# Altium project Zumo LF v2.0.PrjPcb (part 2 of 3)

## Sheet IMU.SchDoc: Motherboard-IMU
size A4; Author: Patryk Bujak; DrawnBy: Patryk Bujak; DocumentNumber: 12; Revision: 1.0; SheetNumber: 7; SheetTotal: 10
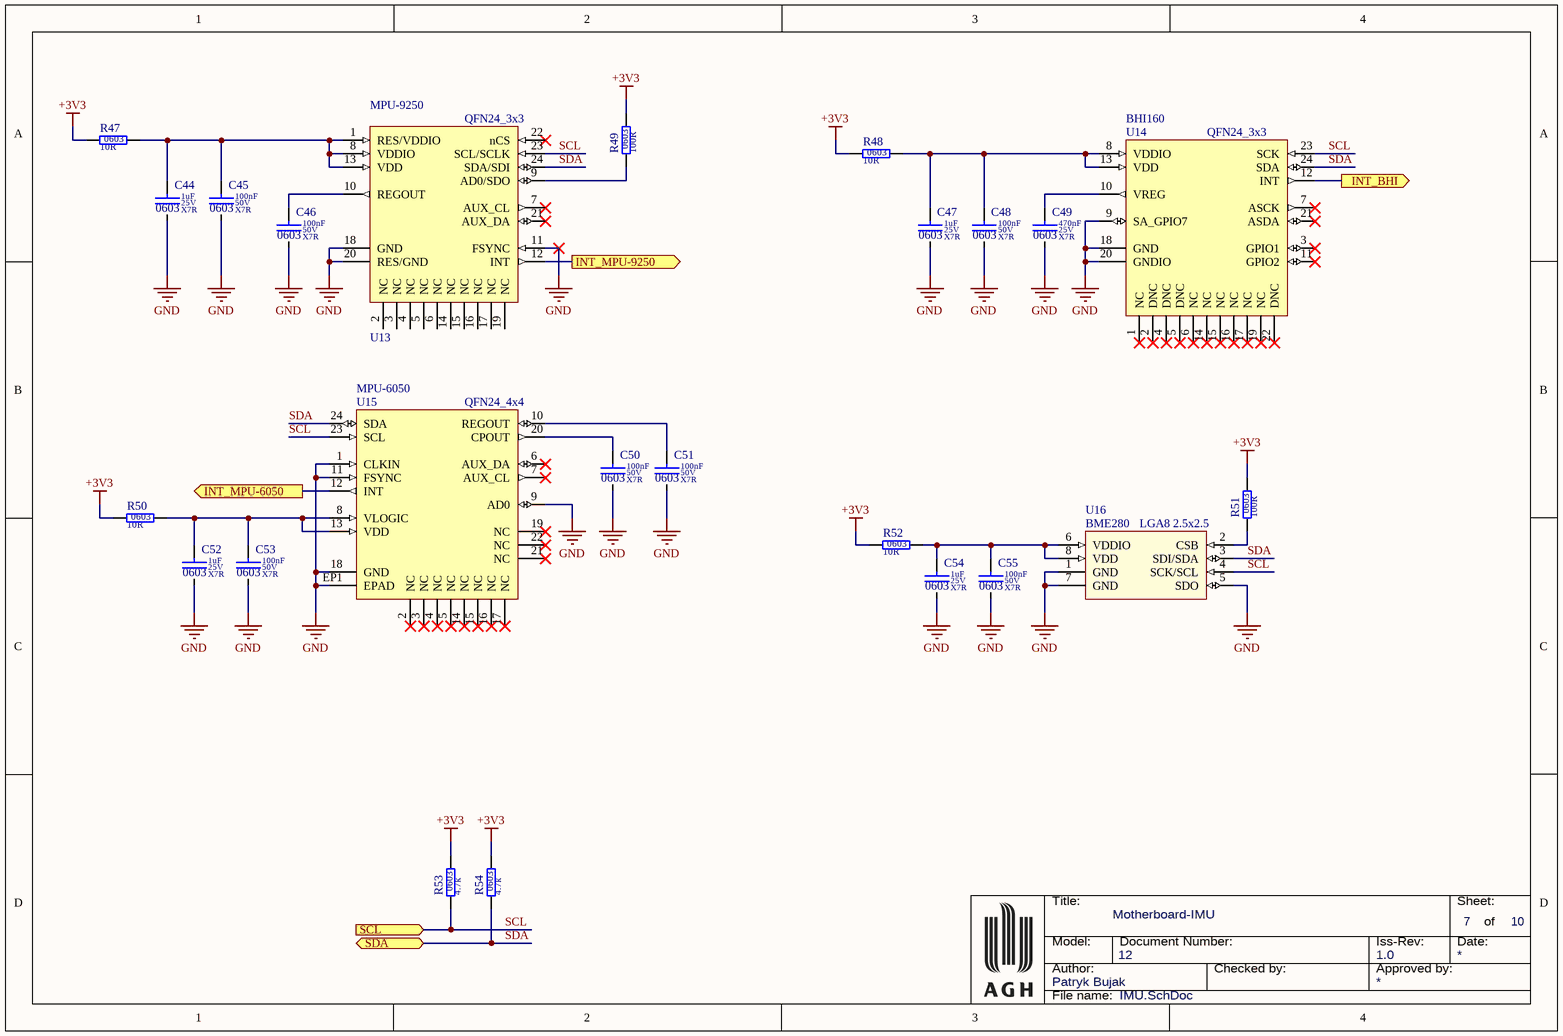
[diagram p5: IMU.SchDoc]

### Parts
C44  value 1uF  Dielectric: X7R  Voltage: 25V  SCH_Footprint: 0603  [C_0603_1608]  (hidden comment: Ceramic X7R)
C45  value 100nF  Dielectric: X7R  Voltage: 50V  SCH_Footprint: 0603  [C_0603_1608]  (hidden comment: Ceramic X7R)
C46  value 100nF  Dielectric: X7R  Voltage: 50V  SCH_Footprint: 0603  [C_0603_1608]  (hidden comment: Ceramic X7R)
C47  value 1uF  Dielectric: X7R  Voltage: 25V  SCH_Footprint: 0603  [C_0603_1608]  (hidden comment: Ceramic X7R)
C48  value 100nF  Dielectric: X7R  Voltage: 50V  SCH_Footprint: 0603  [C_0603_1608]  (hidden comment: Ceramic X7R)
C49  value 470nF  Dielectric: X7R  Voltage: 25V  SCH_Footprint: 0603  [C_0603_1608]  (hidden comment: Ceramic X7R)
C50  value 100nF  Dielectric: X7R  Voltage: 50V  SCH_Footprint: 0603  [C_0603_1608]  (hidden comment: Ceramic X7R)
C51  value 100nF  Dielectric: X7R  Voltage: 50V  SCH_Footprint: 0603  [C_0603_1608]  (hidden comment: Ceramic X7R)
C52  value 1uF  Dielectric: X7R  Voltage: 25V  SCH_Footprint: 0603  [C_0603_1608]  (hidden comment: Ceramic X7R)
C53  value 100nF  Dielectric: X7R  Voltage: 50V  SCH_Footprint: 0603  [C_0603_1608]  (hidden comment: Ceramic X7R)
C54  value 1uF  Dielectric: X7R  Voltage: 25V  SCH_Footprint: 0603  [C_0603_1608]  (hidden comment: Ceramic X7R)
C55  value 100nF  Dielectric: X7R  Voltage: 50V  SCH_Footprint: 0603  [C_0603_1608]  (hidden comment: Ceramic X7R)
R47  value 10R  SCH_Footprint: 0603  [R_0603_1608]  (hidden comment: Resistor)
R48  value 10R  SCH_Footprint: 0603  [R_0603_1608]  (hidden comment: Resistor)
R49  value 100R  SCH_Footprint: 0603  [R_0603_1608]  (hidden comment: Resistor)
R50  value 10R  SCH_Footprint: 0603  [R_0603_1608]  (hidden comment: Resistor)
R51  value 100R  SCH_Footprint: 0603  [R_0603_1608]  (hidden comment: Resistor)
R52  value 10R  SCH_Footprint: 0603  [R_0603_1608]  (hidden comment: Resistor)
R53  value 4.7k  SCH_Footprint: 0603  [R_0603_1608]  (hidden comment: Resistor)
R54  value 4.7k  SCH_Footprint: 0603  [R_0603_1608]  (hidden comment: Resistor)
U13  value MPU-9250  [QFN24_3x3]  (hidden comment: Nine-Axis (Gyro + Accelerometer + Compass) MEMS MotionTracking Device)
U14  value BHI160  [QFN24_3x3]  (hidden comment: Three Axis Ultra Low Power Sensor Hub - LGA-24)
U15  value MPU-6050  [QFN24_4x4]  (hidden comment: Accelerometer and Gyroscope Digital Output 2.5V/3.3V 24-Pin QFN EP)
U16  value BME280  SCH_Footprint: LGA8 2.5x2.5  [LGA8_2.5x2.5]  (hidden comment: Combined humidity and pressure sensor)

### Ports
INT_BHI (out), INT_MPU-6050 (out), INT_MPU-9250 (out), SCL (in), SDA (bidir)

### Nets
+3V3: R47.1 R48.1 R49.2 R50.1 R51.2 R52.1 R53.2 R54.2
GND: C44.2 C45.2 C46.2 C47.2 C48.2 C49.2 C50.2 C51.2 C52.2 C53.2 C54.2 C55.2 U13.11(FSYNC) U13.18(GND) U13.20(RES/GND) U14.9(SA_GPIO7) U14.18(GND) U14.20(GNDIO) U15.1(CLKIN) U15.9(AD0) U15.11(FSYNC) U15.18(GND) U15.EP1(EPAD) U16.1(GND) U16.5(SDO) U16.7(GND)
SCL: R53.1 U13.23(SCL/SCLK) U14.23(SCK) U15.23(SCL) U16.4(SCK/SCL) ; port SCL  [project net BCM3/SCL]
SDA: R54.1 U13.24(SDA/SDI) U14.24(SDA) U15.24(SDA) U16.3(SDI/SDA) ; port SDA  [project net BCM2/SDA]
NetC44_1: C44.1 C45.1 R47.2 U13.1(RES/VDDIO) U13.8(VDDIO) U13.13(VDD)
NetC46_1: C46.1 U13.10(REGOUT)
NetC47_1: C47.1 C48.1 R48.2 U14.8(VDDIO) U14.13(VDD)
NetC49_1: C49.1 U14.10(VREG)
NetC50_1: C50.1 U15.20(CPOUT)
NetC51_1: C51.1 U15.10(REGOUT)
NetC52_1: C52.1 C53.1 R50.2 U15.8(VLOGIC) U15.13(VDD)
NetC54_1: C54.1 C55.1 R52.2 U16.6(VDDIO) U16.8(VDD)
NetR49_1: R49.1 U13.9(AD0/SDO)
NetR51_1: R51.1 U16.2(CSB)
NetU7_24: U15.12(INT) ; port INT_MPU-6050
NetU7_53: U14.12(INT) ; port INT_BHI
NetU7_54: U13.12(INT) ; port INT_MPU-9250

Not connected (* = marked no-connect by the designer): U13 2(NC) 3(NC) 4(NC) 5(NC) 6(NC) 7(AUX_CL)* 14(NC) 15(NC) 16(NC) 17(NC) 19(NC) 21(AUX_DA)* 22(nCS)*; U14 1(NC)* 2(DNC)* 3(GPIO1)* 4(DNC)* 5(DNC)* 6(NC)* 7(ASCK)* 11(GPIO2)* 14(NC)* 15(NC)* 16(NC)* 17(NC)* 19(NC)* 21(ASDA)* 22(DNC)*; U15 2(NC)* 3(NC)* 4(NC)* 5(NC)* 6(AUX_DA)* 7(AUX_CL)* 14(NC)* 15(NC)* 16(NC)* 17(NC)* 19(NC)* 21(NC)* 22(NC)*

### Notes on the sheet
- Title:
- Sheet:
- of
- Author:
- Model:
- Document Number:
- Checked by:
- Iss-Rev:
- Approved by:
- Date:
- File name:

### Library data of the parts
C44 C47 C52 C54 = C_1uF_25V_X7R_0603_10: Capacitor; Manufacturer: Samsung; Manufacturer Part Number: CL10B105KA8NNNC; Tolerance (%): 10; Part Number: C_1uF_25V_X7R_0603_10; HelpURL: http://www.tme.eu/pl/Document/4a42202b32dab16128fe107dd69598cc/samsung-chip-cap.pdf; Supplier 1: TME; Supplier Part Number 1: CL10B105KA8NNNC; Supplier 2: RS Components; Supplier 3: Farnell; Supplier 4: Mouser; Supplier 5: Digi-Key
C45 C46 C48 C50 C51 C53 C55 = C_100nF_50V_X7R_0603_5: Capacitor; Manufacturer: Samsung; Manufacturer Part Number: CL10B104JB8NNNC; Tolerance (%): 5; Part Number: C_100nF_50V_X7R_0603_5; HelpURL: http://www.tme.eu/pl/Document/4a42202b32dab16128fe107dd69598cc/samsung-chip-cap.pdf; Supplier 1: TME; Supplier Part Number 1: CL10B104JB8NNNC; Supplier 2: RS Components; Supplier 3: Farnell; Supplier 4: Mouser; Supplier 5: Digi-Key
C49 = C_470nF_25V_X7R_0603_10: Capacitor; Manufacturer: Murata; Manufacturer Part Number: GRM188R71E474KA12D; Tolerance (%): 10; Part Number: C_470nF_25V_X7R_0603_10; HelpURL: http://www.farnell.com/datasheets/2048708.pdf; Supplier 1: TME; Supplier 2: RS Components; Supplier Part Number 2: 7235654; Supplier 3: Farnell; Supplier Part Number 3: 1828901; Supplier 4: Mouser; Supplier Part Number 4: 81-GRM188R71E474KA12; Supplier 5: Digi-Key; Supplier Part Number 5: 490-3291-1-ND
R47 R48 R50 R52 = R_10R_0603_1: Manufacturer: Royalohm; Manufacturer Part Number: 0603SAF100JT5E; Voltage: 50V; Power: 100mW; Tolerance: 1%; Part Number: R_10R_0603_1; HelpURL: http://www.tme.eu/pl/Document/b315665a56acbc42df513c99b390ad98/ROYALOHM-THICKFILM.pdf; Supplier 1: TME; Supplier Part Number 1: SMD0603-10R-1%; Supplier 2: RS Components; Supplier 3: Farnell; Supplier 4: Mouser; Supplier 5: Digi-Key
R49 R51 = R_100R_0603_1: Manufacturer: Yageo; Manufacturer Part Number: RC0603FR-07100RL; Voltage: 50V; Power: 100mW; Tolerance: 1%; Part Number: R_100R_0603_1; HelpURL: http://www.tme.eu/en/Document/d2a72e545e5c8eb7bf2a04fa97535928/rc0603yageo.pdf; Supplier 1: TME; Supplier Part Number 1: RC0603FR-07100R; Supplier 2: RS Components; Supplier 3: Farnell; Supplier Part Number 3: 2131804; Supplier 4: Mouser; Supplier Part Number 4: 603-RC0603FR-07100RL; Supplier 5: Digi-Key; Supplier Part Number 5: 311-100HRCT-ND
R53 R54 = R_4.7k_0603_1: Manufacturer: Yageo; Manufacturer Part Number: RC0603FR-074K7L; Voltage: 75V; Power: 100mW; Tolerance: 1%; Part Number: R_4.7k_0603_1; HelpURL: http://www.farnell.com/datasheets/2167052.pdf?_ga=2.156163131.1690599162.1548417389-1379097396.1542296996&_gac=1.18389067.1547230258.Cj0KCQiAmuHhBRD0ARIsAFWyPwhX8HcvXnM3tA0ZBodZLzDIjH2ZxLpjT5LWo9bad_HPRbU8LfPq44UaAhEwEALw_wcB; Supplier 1: TME; Supplier Part Number 1: RC0603FR-074K7; Supplier 2: RS Components; Supplier 3: Farnell; Supplier Part Number 3: 9238565; Supplier 4: Mouser; Supplier Part Number 4: 603-RC0603FR-074K7L; Supplier 5: Digi-Key; Supplier Part Number 5: 311-4.70KHRCT-ND
U13 = U_MPU-9250: Manufacturer: InvenSense; SCH_Footprint: QFN24_3x3; Part Number: U_MPU-9250; HelpURL: https://datasheet.octopart.com/MPU-9250-InvenSense-datasheet-21859386.pdf; Manufacturer Part Number: MPU-9250; Supplier 1: TME; Supplier 2: RS Components; Supplier 3: Farnell; Supplier 4: Mouser; Supplier Part Number 4: 410-MPU-9250; Supplier 5: Digi-Key; Supplier Part Number 5: 1428-1019-1-ND
U14 = U_BHI160: Manufacturer: Bosch Tools; SCH_Footprint: QFN24_3x3; Part Number: U_BHI160; HelpURL: https://datasheet.octopart.com/BHI160-Bosch-datasheet-66132459.pdf; Manufacturer Part Number: BHI160; Supplier 1: TME; Supplier 2: RS Components; Supplier 3: Farnell; Supplier 4: Mouser; Supplier Part Number 4: 262-BHI160; Supplier 5: Digi-Key; Supplier Part Number 5: 828-1067-1-ND
U15 = U_MPU-6050: Manufacturer: InvenSense; SCH_Footprint: QFN24_4x4; Part Number: U_MPU-6050; HelpURL: https://datasheet.octopart.com/MPU-6050-InvenSense-datasheet-21631037.pdf; Manufacturer Part Number: MPU-6050; Supplier 1: TME; Supplier 2: RS Components; Supplier Part Number 2: 8837948; Supplier 3: Farnell; Supplier Part Number 3: 1864742; Supplier 4: Mouser; Supplier Part Number 4: 410-MPU-6050; Supplier 5: Digi-Key; Supplier Part Number 5: 1428-1007-1-ND
U16 = U_BME280: Manufacturer: Bosch Tools; Part Number: U_BME280; HelpURL: https://cdn-shop.adafruit.com/datasheets/BST-BME280_DS001-10.pdf; Manufacturer Part Number: BME280; Supplier 1: TME; Supplier 2: RS Components; Supplier 3: Farnell; Supplier 4: Mouser; Supplier Part Number 4: 262-BME280; Supplier 5: Digi-Key; Supplier Part Number 5: 828-1063-1-ND

## Sheet ESP32.SchDoc: Motherboard-ESP32
size A3; DrawnBy: Patryk Bujak; DocumentNumber: 12; Revision: 1.0; SheetNumber: 9; SheetTotal: 10; Author: Patryk Bujak
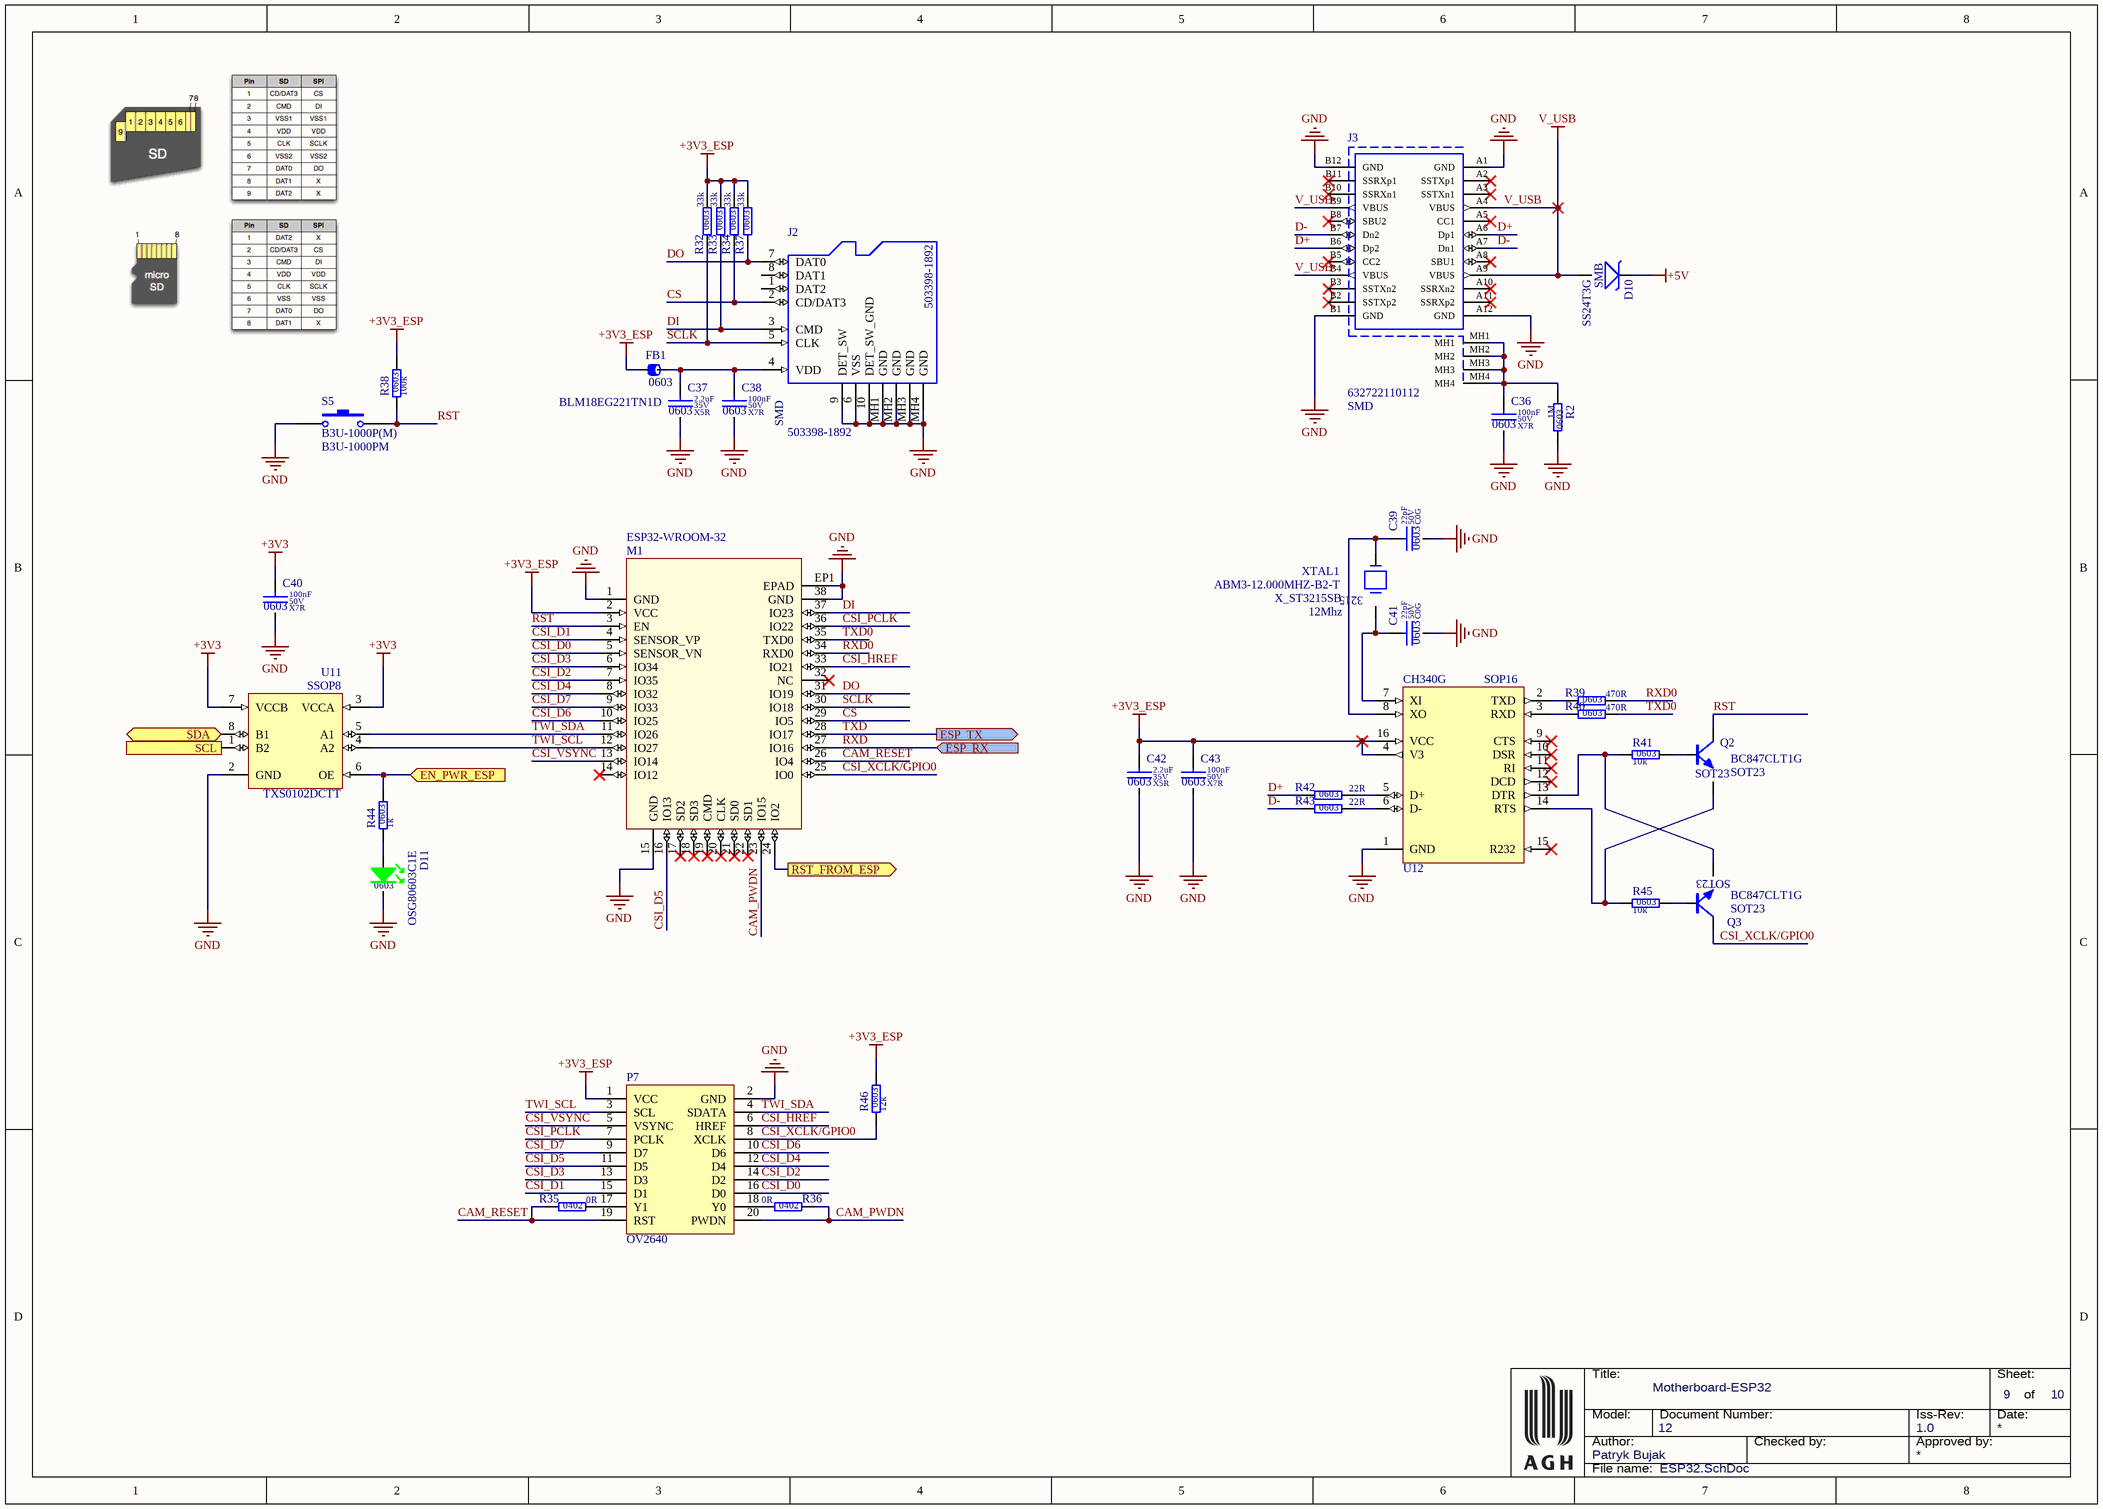
[diagram p6: ESP32.SchDoc]

### Parts
C36  value 100nF  Dielectric: X7R  Voltage: 50V  SCH_Footprint: 0603  [C_0603_1608]  (hidden comment: Ceramic X7R)
C37  value 2.2uF  Dielectric: X5R  Voltage: 35V  SCH_Footprint: 0603  [C_0603_1608]  (hidden comment: Ceramic X5R)
C38  value 100nF  Dielectric: X7R  Voltage: 50V  SCH_Footprint: 0603  [C_0603_1608]  (hidden comment: Ceramic X7R)
C39  value 22pF  Dielectric: C0G  Voltage: 50V  SCH_Footprint: 0603  [C_0603_1608]  (hidden comment: Ceramic C0G)
C40  value 100nF  Dielectric: X7R  Voltage: 50V  SCH_Footprint: 0603  [C_0603_1608]  (hidden comment: Ceramic X7R)
C41  value 22pF  Dielectric: C0G  Voltage: 50V  SCH_Footprint: 0603  [C_0603_1608]  (hidden comment: Ceramic C0G)
C42  value 2.2uF  Dielectric: X5R  Voltage: 35V  SCH_Footprint: 0603  [C_0603_1608]  (hidden comment: Ceramic X5R)
C43  value 100nF  Dielectric: X7R  Voltage: 50V  SCH_Footprint: 0603  [C_0603_1608]  (hidden comment: Ceramic X7R)
D10  value SS24T3G  SCH_Footprint: SMB  [SMB_DO-214AA]  (hidden comment: SS24)
D11  value OSG80603C1E  SCH_Footprint: 0603  [OL_0603_1608]  (hidden comment: Green led)
FB1  value BLM18EG221TN1D  SCH_Footprint: 0603  [FB_0603_1608]  (hidden comment: Ferrite bead)
J2  value 503398-1892  SCH_Footprint: SMD  [503398-1892]  (hidden comment: SD Card Connector)
J3  value 632722110112  SCH_Footprint: SMD  [J_USB_C_3.1_Vertical]  (hidden comment: USB C Connector)
M1  value ESP32-WROOM-32  [MOD_ESP_WROOM_32]  (hidden comment: 2.4 GHz Wi-Fi-and-Bluetooth combo chip)
P7  OV2640  [H2X10_OV2640]
Q2  value BC847CLT1G  SCH_Footprint: SOT23  [SOT23_TO236_SC59]  (hidden comment: BC847C)
Q3  value BC847CLT1G  SCH_Footprint: SOT23  [SOT23_TO236_SC59]  (hidden comment: BC847C)
R2  value 1M  SCH_Footprint: 0603  [R_0603_1608]  (hidden comment: Resistor)
R32  value 33k  SCH_Footprint: 0603  [R_0603_1608]  (hidden comment: Resistor)
R33  value 33k  SCH_Footprint: 0603  [R_0603_1608]  (hidden comment: Resistor)
R34  value 33k  SCH_Footprint: 0603  [R_0603_1608]  (hidden comment: Resistor)
R35  value 0R  SCH_Footprint: 0402  [R_0402_1005]  (hidden comment: Resistor)
R36  value 0R  SCH_Footprint: 0402  [R_0402_1005]  (hidden comment: Resistor)
R37  value 33k  SCH_Footprint: 0603  [R_0603_1608]  (hidden comment: Resistor)
R38  value 100k  SCH_Footprint: 0603  [R_0603_1608]  (hidden comment: Resistor)
R39  value 470R  SCH_Footprint: 0603  [R_0603_1608]  (hidden comment: Resistor)
R40  value 470R  SCH_Footprint: 0603  [R_0603_1608]  (hidden comment: Resistor)
R41  value 10k  SCH_Footprint: 0603  [R_0603_1608]  (hidden comment: Resistor)
R42  value 22R  SCH_Footprint: 0603  [R_0603_1608]  (hidden comment: Resistor)
R43  value 22R  SCH_Footprint: 0603  [R_0603_1608]  (hidden comment: Resistor)
R44  value 1k  SCH_Footprint: 0603  [R_0603_1608]  (hidden comment: Resistor)
R45  value 10k  SCH_Footprint: 0603  [R_0603_1608]  (hidden comment: Resistor)
R46  value 12k  SCH_Footprint: 0603  [R_0603_1608]  (hidden comment: Resistor)
S5  value B3U-1000PM  SCH_Footprint: B3U-1000P(M)  [B3U-1000P]  (hidden comment: Ultra-small Tactile Switch)
U11  value TXS0102DCTT  SCH_Footprint: SSOP8  [SSOP8_3x3]  (hidden comment: 2-Bit Bidirectional Voltage-Level Shifter for Open-Drain and Push-Pull Application 8-VSSOP -40 to 85)
U12  value CH340G  SCH_Footprint: SOP16  [SOP16_SO16_SOIC16_4X10X6]  (hidden comment: USB to serial chip)
XTAL1  value 12Mhz  Manufacturer Part Number: ABM3-12.000MHZ-B2-T  [X_ABM3-12.000MHZ-B2-T]  (hidden comment: X_ST3215SB)

### Ports
EN_PWR_ESP (in), ESP_RX (in), ESP_TX (out), RST_FROM_ESP (out), SCL (in), SDA (bidir)

### Nets
+3V3: C40.1 U11.3(VCCA) U11.7(VCCB)
+3V3_ESP: C42.1 C43.1 FB1.1 M1.2(VCC) P7.1(VCC) R32.2 R33.2 R34.2 R37.2 R38.2 R46.2 U12.4(V3) U12.16(VCC)
+5V: D10.1
GND: C36.2 C37.2 C38.2 C39.2 C40.2 C41.2 C42.2 C43.2 D11.1(K) J2.6(VSS) J2.9(DET_SW) J2.10(DET_SW_GND) J2.MH1(GND) J2.MH2(GND) J2.MH3(GND) J2.MH4(GND) J3.A1(GND) J3.A12(GND) J3.B1(GND) J3.B12(GND) M1.1(GND) M1.15(GND) M1.38(GND) M1.EP1(EPAD) P7.2(GND) R2.2 S5.1 U11.2(GND) U12.1(GND)
V_USB: D10.2 J3.A4(VBUS) J3.A9(VBUS) J3.B4(VBUS) J3.B9(VBUS)
BCM2/SDA: U11.8(B1) ; port SDA
BCM3/SCL: U11.1(B2) ; port SCL
CAM_PWDN: M1.23(IO15) P7.20(PWDN) R36.2
CAM_RESET: M1.26(IO4) P7.19(RST) R35.1
CS: J2.2(CD/DAT3) M1.29(IO5) R34.1
CSI_D0: M1.5(SENSOR_VN) P7.16(D0)
CSI_D1: M1.4(SENSOR_VP) P7.15(D1)
CSI_D2: M1.7(IO35) P7.14(D2)
CSI_D3: M1.6(IO34) P7.13(D3)
CSI_D4: M1.8(IO32) P7.12(D4)
CSI_D5: M1.16(IO13) P7.11(D5)
CSI_D6: M1.10(IO25) P7.10(D6)
CSI_D7: M1.9(IO33) P7.9(D7)
CSI_HREF: M1.33(IO21) P7.6(HREF)
CSI_PCLK: M1.36(IO22) P7.7(PCLK)
CSI_VSYNC: M1.13(IO14) P7.5(VSYNC)
CSI_XCLK/GPIO0: M1.25(IO0) P7.8(XCLK) Q3.3(C) R46.1
D+: J3.A6(Dp1) J3.B6(Dp2) R42.1
D-: J3.A7(Dn1) J3.B7(Dn2) R43.1
DI: J2.3(CMD) M1.37(IO23) R33.1
DO: J2.7(DAT0) M1.31(IO19) R37.1
RST: M1.3(EN) Q2.3(C) R38.1 S5.2
RXD: M1.27(IO16) ; port ESP_RX
RXD0: M1.34(RXD0) R39.2
SCLK: J2.5(CLK) M1.30(IO18) R32.1
TWI_SCL: M1.12(IO27) P7.3(SCL) U11.4(A2)
TWI_SDA: M1.11(IO26) P7.4(SDATA) U11.5(A1)
TXD: M1.28(IO17) ; port ESP_TX
TXD0: M1.35(TXD0) R40.2
NetC36_1: C36.1 J3.MH1 J3.MH2 J3.MH3 J3.MH4 R2.1
NetC37_1: C37.1 C38.1 FB1.2 J2.4(VDD)
NetC39_1: C39.1 U12.8(XO) XTAL1.2
NetC41_1: C41.1 U12.7(XI) XTAL1.1
NetD11_2: D11.2(A) R44.1
NetM1_24: M1.24(IO2) ; port RST_FROM_ESP
NetP7_17: P7.17(Y1) R35.2
NetP7_18: P7.18(Y0) R36.1
NetQ2_1: Q2.1(B) R41.2
NetQ2_2: Q2.2(E) R45.1 U12.14(RTS)
NetQ3_1: Q3.1(B) R45.2
NetQ3_2: Q3.2(E) R41.1 U12.13(DTR)
NetR11_2: R44.2 U11.6(OE) ; port EN_PWR_ESP
NetR39_1: R39.1 U12.2(TXD)
NetR40_1: R40.1 U12.3(RXD)
NetR42_2: R42.2 U12.5(D+)
NetR43_2: R43.2 U12.6(D-)

Not connected (* = marked no-connect by the designer): J2 1(DAT2) 8(DAT1); J3 A2(SSTXp1)* A3(SSTXn1)* A5(CC1)* A8(SBU1)* A10(SSRXn2)* A11(SSRXp2)* B2(SSTXp2)* B3(SSTXn2)* B5(CC2)* B8(SBU2)* B10(SSRXn1)* B11(SSRXp1)*; M1 14(IO12)* 17(SD2)* 18(SD3)* 19(CMD)* 20(CLK)* 21(SD0)* 22(SD1)* 32(NC)*; U12 9(CTS)* 10(DSR)* 11(RI)* 12(DCD)* 15(R232)*

### Notes on the sheet
- Title:
- Sheet:
- of
- Author:
- Model:
- Document Number:
- Checked by:
- Iss-Rev:
- Approved by:
- Date:
- File name:
- (in symbol X_ABM3-12.000MHZ-B2-T) 3215

### Library data of the parts
C36 C38 C40 C43 = C_100nF_50V_X7R_0603_5: as C45 on sheet IMU; Part Number: C_100nF_50V_X7R_0603_5; HelpURL: http://www.tme.eu/pl/Document/4a42202b32dab16128fe107dd69598cc/samsung-chip-cap.pdf; Supplier 1: TME; Supplier Part Number 1: CL10B104JB8NNNC; Supplier 2: RS Components; Supplier 3: Farnell; Supplier 4: Mouser; Supplier 5: Digi-Key
C37 C42 = C_2.2uF_35V_X5R_0603_10: Capacitor; Manufacturer: Murata; Manufacturer Part Number: GRM188R6YA225KA12D; Tolerance (%): 10; Part Number: C_2.2uF_35V_X5R_0603_10; HelpURL: https://datasheet.octopart.com/GRM188R6YA225KA12D-Murata-datasheet-66077095.pdf; Supplier 1: TME; Supplier 2: RS Components; Supplier Part Number 2: 8151358; Supplier 3: Farnell; Supplier Part Number 3: 2611926; Supplier 4: Mouser; Supplier Part Number 4: 81-GRM188R6YA225KA2D; Supplier 5: Digi-Key; Supplier Part Number 5: 490-7204-1-ND
C39 C41 = C_22pF_50V_C0G_0603_5: Capacitor; Manufacturer: AVX; Manufacturer Part Number: 06035A220JAT2A; Tolerance (%): 5; Part Number: C_22pF_50V_C0G_0603_5; HelpURL: https://datasheet.octopart.com/06035A220JAT2A-AVX-datasheet-9883399.pdf; Supplier 1: TME; Supplier 2: RS Components; Supplier Part Number 2: 1349628; Supplier 3: Farnell; Supplier Part Number 3: 2280861; Supplier 4: Mouser; Supplier Part Number 4: 581-06035A220J; Supplier 5: Digi-Key; Supplier Part Number 5: 478-1167-1-ND
D10 = DS_SS24_2A_40V_SMB: Manufacturer: ON Semiconductor; Voltage: 40V; Current: 2A; Part Number: DS_SS24_2A_40V_SMB; Manufacturer Part Number: SS24T3G; Supplier 1: TME; Supplier 2: RS Components; Supplier 3: Farnell; Supplier 4: Mouser; Supplier 5: Digi-Key; Supplier Part Number 5: SS24T3GOSCT-ND
D11 = OL_G_0603_OSG80603C1E: LED GREEN; Manufacturer: Optosupply; Part Number: OL_G_0603_OSG80603C1E; Manufacturer Part Number: OSG80603C1E; Supplier 1: TME; Supplier Part Number 1: OSG80603C1E; Supplier 2: RS Components; Supplier 3: Farnell; Supplier 4: Mouser; Supplier 5: Digi-Key
FB1 = FB_BLM18EG221TN1D: Manufacturer: Murata; Current: 1A; Resistance: 150mR; Part Number: FB_BLM18EG221TN1D; HelpURL: http://datasheet.octopart.com/BLM18EG221TN1D-Murata-datasheet-66919.pdf; Manufacturer Part Number: BLM18EG221TN1D; Supplier 1: TME; Supplier 2: RS Components; Supplier Part Number 2: 7926243P; Supplier 3: Farnell; Supplier Part Number 3: 1515717; Supplier 4: Mouser; Supplier Part Number 4: 81-BLM18EG221TN1D; Supplier 5: Digi-Key; Supplier Part Number 5: 490-5979-1-ND
J2 = J_MICRO_SD_503398-1892: J_MICRO_SD; Manufacturer: Molex; Manufacturer Part Number: 503398-1892; Part Number: J_MICRO_SD_503398-1892; Component Type: Standard; HelpURL: https://www.molex.com/pdm_docs/sd/5033981892_sd.pdf; Supplier 1: TME; Supplier Part Number 1: MX-503398-1892; Supplier 2: RS Components; Supplier Part Number 2: 8801277P; Supplier 3: Farnell; Supplier Part Number 3: 2358233; Supplier 4: Mouser; Supplier Part Number 4: 538-503398-1892; Supplier 5: Digi-Key; Supplier Part Number 5: WM11190CT-ND
J3 = J_USB_C_3.1_Vertical: Manufacturer: Wurth; Part Number: J_USB_C_3.1_Vertical; Component Type: Standard; HelpURL: https://docs-emea.rs-online.com/webdocs/16e6/0900766b816e664c.pdf; Manufacturer Part Number: 632722110112; Supplier 1: TME; Supplier 2: RS Components; Supplier Part Number 2: 185-4394; Supplier 3: Farnell; Supplier 4: Mouser; Supplier Part Number 4: 710-632722110112; Supplier 5: Digi-Key; Supplier Part Number 5: 732-13724-1-ND
M1 = MOD_ESP32-WROOM-32: Manufacturer: ESPRESSIF; SCH_Footprint: MOD_ESP_WROOM_32; Part Number: MOD_ESP32-WROOM-32; HelpURL: https://www.espressif.com/sites/default/files/documentation/esp32_datasheet_en.pdf; Manufacturer Part Number: ESP32-WROOM-32; Supplier 1: TME; Supplier Part Number 1: ESP32-WROOM-32; Supplier 2: RS Components; Supplier Part Number 2: 169-7594; Supplier 3: Farnell; Supplier 4: Mouser; Supplier Part Number 4: 356-ESP-WROOM-32; Supplier 5: Digi-Key; Supplier Part Number 5: 1904-1010-1-ND
P7 = OV2640: Header, 11-Pin, Dual row, Right Angle; LatestRevisionDate: 17-Jul-2002; LatestRevisionNote: Re-released for DXP Platform.; Publisher: Altium Limited; botland: https://botland.com.pl/pl/kamery-do-arduino-i-raspberry-pi/6562-modul-kamery-arducam-ov2640-2mpx-1600x1200px-60fps.html?search_query=OV2640&results=11; link: https://www.arducam.com/products/camera-breakout-board/2mp-ov2640/
Q2 Q3 = QNP_BC847C_45V_0A1: Manufacturer: ON Semiconductor; Type: NPN; Voltage: 45V; Current: 0A1; Part Number: QNP_BC847C_45V_0A1; HelpURL: https://assets.nexperia.com/documents/data-sheet/BC847_SER.pdf; Manufacturer Part Number: BC847CLT1G; Supplier 1: TME; Supplier Part Number 1: BC847CLT1G; Supplier 2: RS Components; Supplier 3: Farnell; Supplier 4: Mouser; Supplier 5: Digi-Key; Supplier Part Number 5: BC847CLT1GOSCT-ND
R2 = R_1M_0603_1: Manufacturer: Bourns; Manufacturer Part Number: CR0603-FX-1004ELF; Voltage: 50V; Power: 100mW; Tolerance: 1%; Part Number: R_1M_0603_1; HelpURL: https://datasheet.octopart.com/CR0603-FX-1004ELF-Bourns-datasheet-5318152.pdf; Supplier 1: TME; Supplier 2: RS Components; Supplier 3: Farnell; Supplier Part Number 3: 2321755; Supplier 4: Mouser; Supplier Part Number 4: 652-CR0603FX-1004ELF; Supplier 5: Digi-Key; Supplier Part Number 5: CR0603-FX-1004ELFCT-ND
R32-R34 R37 = R_33k_0603_1: Manufacturer: Vishay; Manufacturer Part Number: CRCW060333K0FKTABC; Voltage: 75V; Power: 100mW; Tolerance: 1%; Part Number: R_33k_0603_1; HelpURL: http://www.tme.eu/pl/Document/622e28308c06d160637f2b14751ba16b/Data%20Sheet%20CRCW_BCe3.pdf; Supplier 1: TME; Supplier Part Number 1: CRCW060333K0FKTABC; Supplier 2: RS Components; Supplier 3: Farnell; Supplier 4: Mouser; Supplier Part Number 4: 71-CRCW0603-33K; Supplier 5: Digi-Key
R35 R36 = R_0R_0402_5: Manufacturer: Rohm; Manufacturer Part Number: PMR01ZZPJ000; Voltage: 50V; Power: 100mW; Tolerance: 5%; Part Number: R_0R_0402_5; HelpURL: https://pl.mouser.com/datasheet/2/348/pmr-jpw-e-1139188.pdf; Supplier 1: TME; Supplier 2: RS Components; Supplier 3: Farnell; Supplier 4: Mouser; Supplier Part Number 4: 755-PMR01ZZPJ000; Supplier 5: Digi-Key; Supplier Part Number 5: RHM1692-6-ND
R38 = R_100k_0603_1: Manufacturer: Royalohm; Manufacturer Part Number: 0603SAF1003T5E; Voltage: 50V; Power: 100mW; Tolerance: 1%; Part Number: R_100k_0603_1; HelpURL: http://www.tme.eu/pl/Document/b315665a56acbc42df513c99b390ad98/ROYALOHM-THICKFILM.pdf; Supplier 1: TME; Supplier Part Number 1: SMD0603-100K-1%; Supplier 2: RS Components; Supplier 3: Farnell; Supplier 4: Mouser; Supplier Part Number 4: 667-ERJ-3EKF1003V; Supplier 5: Digi-Key; Supplier Part Number 5: P100KHCT-ND
R39 R40 = R_470R_0603_1: Manufacturer: Yageo; Manufacturer Part Number: RC0603FR-07470RL; Voltage: 50V; Power: 100mW; Tolerance: 1%; Part Number: R_470R_0603_1; HelpURL: http://www.tme.eu/en/Document/9fef8ccbb584e9f6a1c931cf356afd5c/PYu-RC0603_51_RoHS_L_4.pdf; Supplier 1: TME; Supplier Part Number 1: RC0603FR-07470R; Supplier 2: RS Components; Supplier 3: Farnell; Supplier Part Number 3: 9238441; Supplier 4: Mouser; Supplier Part Number 4: 603-RC0603FR-07470RL; Supplier 5: Digi-Key; Supplier Part Number 5: 311-470HRCT-ND
R41 R45 = R_10k_0603_1: Manufacturer: Vishay; Manufacturer Part Number: CRCW060310K0FKTABC; Voltage: 75V; Power: 100mW; Tolerance: 1%; Part Number: R_10k_0603_1; HelpURL: http://www.tme.eu/pl/Document/622e28308c06d160637f2b14751ba16b/Data%20Sheet%20CRCW_BCe3.pdf; Supplier 1: TME; Supplier Part Number 1: CRCW060310K0FKTABC; Supplier 2: RS Components; Supplier 3: Farnell; Supplier 4: Mouser; Supplier Part Number 4: 667-ERJ-3EKF1002V; Supplier 5: Digi-Key; Supplier Part Number 5: P10KGCT-ND
R42 R43 = R_22R_0603_5: Manufacturer: Walsin; Manufacturer Part Number: WF06P220JTL; Voltage: 50V; Power: 125mW; Tolerance: 5%; Part Number: R_22R_0603_5; HelpURL: http://www.tme.eu/pl/Document/b315665a56acbc42df513c99b390ad98/ROYALOHM-THICKFILM.pdf; Supplier 1: TME; Supplier Part Number 1: WF06P-22R-5%; Supplier 2: RS Components; Supplier 3: Farnell; Supplier 4: Mouser; Supplier 5: Digi-Key
R44 = R_1k_0603_1: Manufacturer: Vishay; Manufacturer Part Number: CRCW06031K00FKEA; Voltage: 75V; Power: 100mW; Tolerance: 1%; Part Number: R_1k_0603_1; HelpURL: http://www.farnell.com/datasheets/2310790.pdf?_ga=2.256888843.1690599162.1548417389-1379097396.1542296996&_gac=1.262631934.1547230258.Cj0KCQiAmuHhBRD0ARIsAFWyPwhX8HcvXnM3tA0ZBodZLzDIjH2ZxLpjT5LWo9bad_HPRbU8LfPq44UaAhEwEALw_wcB; Supplier 1: TME; Supplier 2: RS Components; Supplier Part Number 2: 678-9875P; Supplier 3: Farnell; Supplier Part Number 3: 1469740; Supplier 4: Mouser; Supplier Part Number 4: 71-CRCW0603-1.0K-E3; Supplier 5: Digi-Key; Supplier Part Number 5: 541-1.00KHCT-ND
R46 = R_12k_0603_1: Manufacturer: Yageo; Manufacturer Part Number: RC0603FR-0712KL; Voltage: 50V; Power: 100mW; Tolerance: 1%; Part Number: R_12k_0603_1; HelpURL: http://www.tme.eu/pl/Document/d2a72e545e5c8eb7bf2a04fa97535928/rc0603yageo.pdf; Supplier 1: TME; Supplier Part Number 1: RC0603FR-0712K; Supplier 2: RS Components; Supplier 3: Farnell; Supplier Part Number 3: 2693657; Supplier 4: Mouser; Supplier Part Number 4: 603-RC0603FR-0712KL; Supplier 5: Digi-Key; Supplier Part Number 5: 311-12.0KHRCT-ND
S5 = S_B3U-1000PM: Tact Switch; Manufacturer: OMRON; Part Number: S_B3U-1000PM; HelpURL: https://www.tme.eu/Document/abdade7e1ca56d20235b5c747d7227eb/B3U.PDF; Manufacturer Part Number: B3U-1000PM; Supplier 1: TME; Supplier Part Number 1: B3U-1000PM; Supplier 2: RS Components; Supplier 3: Farnell; Supplier 4: Mouser; Supplier Part Number 4: 653-B3U-1000PM; Supplier 5: Digi-Key
U11 = U_TXS0102DCTT: Manufacturer: Texas Instruments; Part Number: U_TXS0102DCTT; HelpURL: http://www.ti.com/lit/ds/symlink/txs0102.pdf; Manufacturer Part Number: TXS0102DCTT; Supplier 1: TME; Supplier 2: RS Components; Supplier Part Number 2: 7098912P; Supplier 3: Farnell; Supplier Part Number 3: 2098018; Supplier 4: Mouser; Supplier Part Number 4: 595-TXS0102DCTT; Supplier 5: Digi-Key; Supplier Part Number 5: 296-32603-1-ND
U12 = U_CH340G: Manufacturer: WCH; Part Number: U_CH340G; HelpURL: https://www.mpja.com/download/35227cpdata.pdf; Manufacturer Part Number: CH340G; Supplier 1: TME; Supplier 2: RS Components; Supplier 3: Farnell; Supplier 4: Mouser; Supplier 5: Digi-Key; Supplier 6: WCH; Supplier Part Number 6: CH340G
XTAL1 = X_ABM3-12.000MHZ-B2-T: Manufacturer: ABM3; Part Number: X_ABM3-12.000MHZ-B2-T; SCH_Footprint: X_ST3215SB; HelpURL: http://www.mouser.com/ds/2/3/abm3-47699.pdf; Supplier 1: TME; Supplier 2: RS Components; Supplier 3: Farnell; Supplier Part Number 3: 2467787; Supplier 4: Mouser; Supplier 5: Digi-Key; Supplier Part Number 5: 535-9100-1-ND

## Sheet RPi.SchDoc: Motherboard-RPi
size A4; Author: Patryk Bujak; DrawnBy: Patryk Bujak; DocumentNumber: 12; Revision: 1.0; SheetNumber: 5; SheetTotal: 10
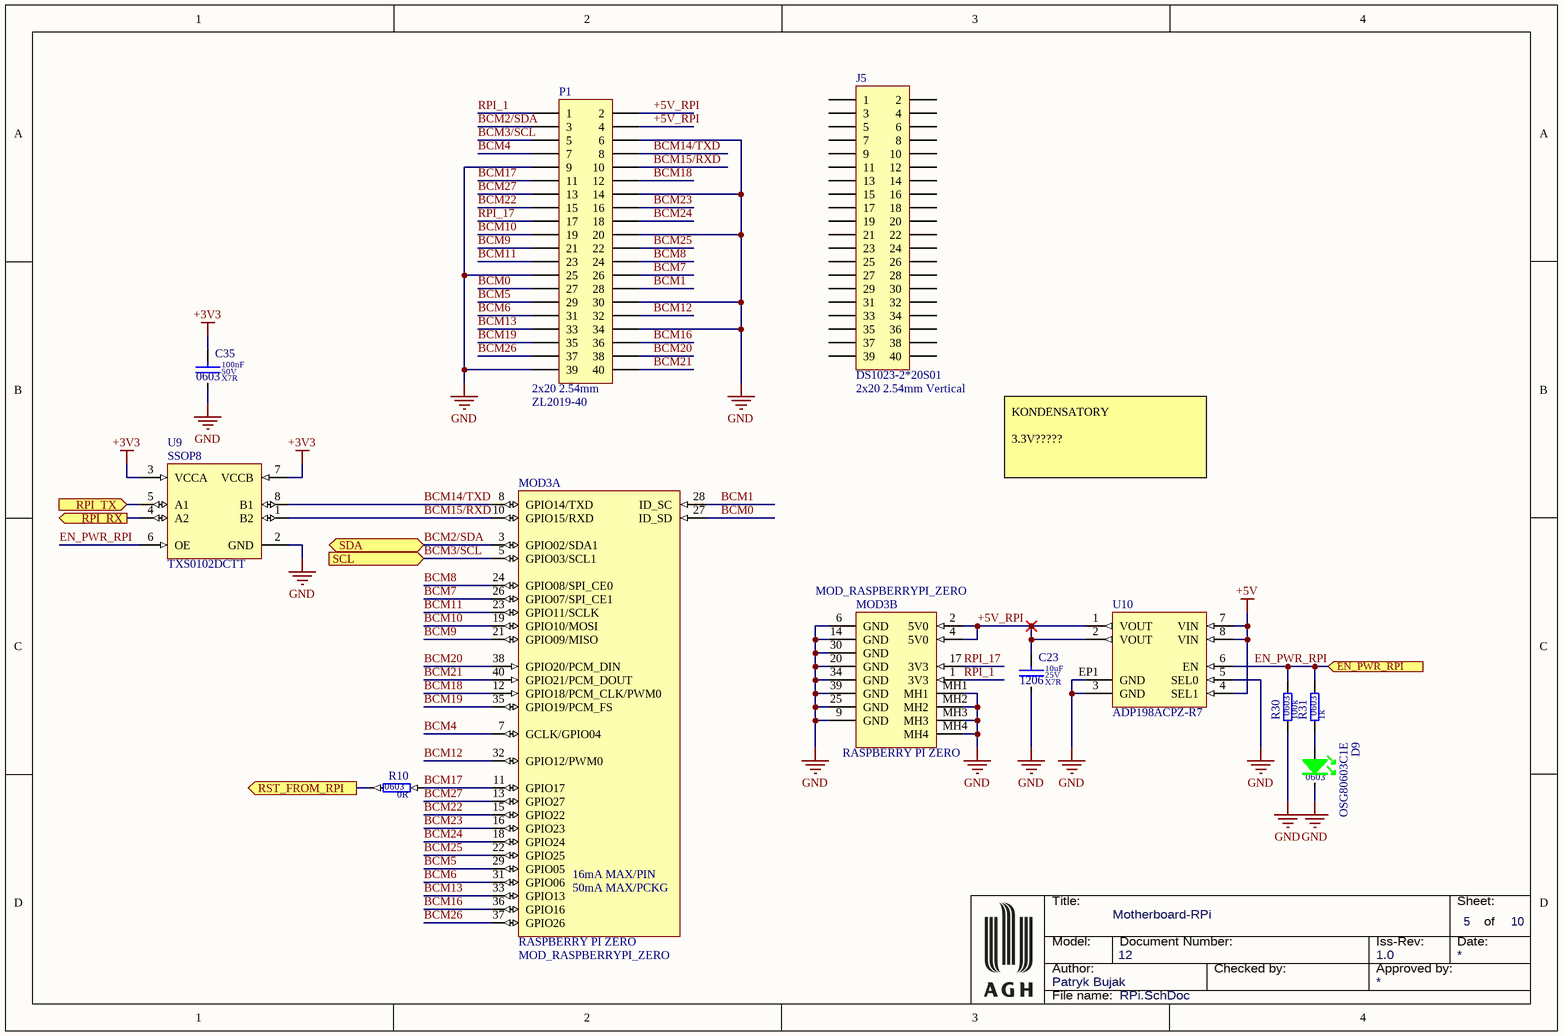
[diagram p7: RPi.SchDoc]

### Parts
C23  value 10uF  Dielectric: X7R  Voltage: 25V  SCH_Footprint: 1206  [C_1206_3216]  (hidden comment: Ceramic X7R)
C35  value 100nF  Dielectric: X7R  Voltage: 50V  SCH_Footprint: 0603  [C_0603_1608]  (hidden comment: Ceramic X7R)
D9  value OSG80603C1E  SCH_Footprint: 0603  [OL_0603_1608]  (hidden comment: Green led)
J5  value DS1023-2*20S01  SCH_Footprint: 2x20 2.54mm Vertical  [J_HEADER_2x20_2.54_VERTICAL]  (hidden comment: Goldpin female straight)
MOD3  value RASPBERRY PI ZERO  [MOD_RASPBERRYPI_ZERO]  (hidden comment: MOD_RASPBERRYPI_ZERO)  (parts A,B of 2)
P1  value ZL2019-40  SCH_Footprint: 2x20 2.54mm  [P_HEADER_2x20_2.54_HIGH]  (hidden comment: Goldpin)
R10  value 0R  SCH_Footprint: 0603  [R_0603_1608]  (hidden comment: Resistor)
R30  value 100k  SCH_Footprint: 0603  [R_0603_1608]  (hidden comment: Resistor)
R31  value 1k  SCH_Footprint: 0603  [R_0603_1608]  (hidden comment: Resistor)
U9  value TXS0102DCTT  SCH_Footprint: SSOP8  [SSOP8_3x3]  (hidden comment: 2-Bit Bidirectional Voltage-Level Shifter for Open-Drain and Push-Pull Application 8-VSSOP -40 to 85)
U10  value ADP198ACPZ-R7  SCH_Footprint: LFCSP8  [LFCSP-8-10]  (hidden comment: high-side load switch)

### Ports
EN_PWR_RPI (in), RPI_RX (out), RPI_TX (in), RST_FROM_RPI (out), SCL (in), SDA (bidir)

### Nets
+3V3: C35.1 U9.3(VCCA) U9.7(VCCB)
+5V: U10.4(SEL1) U10.7(VIN) U10.8(VIN)
GND: C23.2 C35.2 D9.1(K) MOD3.6(GND) MOD3.9(GND) MOD3.14(GND) MOD3.20(GND) MOD3.25(GND) MOD3.30(GND) MOD3.34(GND) MOD3.39(GND) MOD3.MH1 MOD3.MH2 MOD3.MH3 MOD3.MH4 P1.6 P1.9 P1.14 P1.20 P1.25 P1.30 P1.34 P1.39 R30.1 U9.2(GND) U10.3(GND) U10.5(SEL0) U10.EP1(GND)
+5V_RPI: C23.1 MOD3.2(5V0) MOD3.4(5V0) P1.2 P1.4 U10.1(VOUT) U10.2(VOUT)
BCM0: MOD3.27(ID_SD) P1.27
BCM1: MOD3.28(ID_SC) P1.28
BCM2/SDA: MOD3.3(GPIO02/SDA1) P1.3 ; port SDA
BCM3/SCL: MOD3.5(GPIO03/SCL1) P1.5 ; port SCL
BCM4: MOD3.7(GCLK/GPIO04) P1.7
BCM5: MOD3.29(GPIO05) P1.29
BCM6: MOD3.31(GPIO06) P1.31
BCM7: MOD3.26(GPIO07/SPI_CE1) P1.26
BCM8: MOD3.24(GPIO08/SPI_CE0) P1.24
BCM9: MOD3.21(GPIO09/MISO) P1.21
BCM10: MOD3.19(GPIO10/MOSI) P1.19
BCM11: MOD3.23(GPIO11/SCLK) P1.23
BCM12: MOD3.32(GPIO12/PWM0) P1.32
BCM13: MOD3.33(GPIO13) P1.33
BCM14/TXD: MOD3.8(GPIO14/TXD) P1.8 U9.8(B1)
BCM15/RXD: MOD3.10(GPIO15/RXD) P1.10 U9.1(B2)
BCM16: MOD3.36(GPIO16) P1.36
BCM17: MOD3.11(GPIO17) P1.11 R10.1
BCM18: MOD3.12(GPIO18/PCM_CLK/PWM0) P1.12
BCM19: MOD3.35(GPIO19/PCM_FS) P1.35
BCM20: MOD3.38(GPIO20/PCM_DIN) P1.38
BCM21: MOD3.40(GPIO21/PCM_DOUT) P1.40
BCM22: MOD3.15(GPIO22) P1.15
BCM23: MOD3.16(GPIO23) P1.16
BCM24: MOD3.18(GPIO24) P1.18
BCM25: MOD3.22(GPIO25) P1.22
BCM26: MOD3.37(GPIO26) P1.37
BCM27: MOD3.13(GPIO27) P1.13
EN_PWR_RPI: R30.2 R31.2 U9.6(OE) U10.6(EN) ; port EN_PWR_RPI
RPI_1: MOD3.1(3V3) P1.1
RPI_17: MOD3.17(3V3) P1.17
NetD9_2: D9.2(A) R31.1
NetR10_2: R10.2 ; port RST_FROM_RPI
NetU7_55: U9.5(A1) ; port RPI_TX
NetU7_56: U9.4(A2) ; port RPI_RX

Not connected (* = marked no-connect by the designer): J5 1 2 3 4 5 6 7 8 9 10 11 12 13 14 15 16 17 18 19 20 21 22 23 24 25 26 27 28 29 30 31 32 33 34 35 36 37 38 39 40

### Notes on the sheet
- KONDENSATORY
  3.3V?????
- Title:
- Sheet:
- of
- Author:
- Model:
- Document Number:
- Checked by:
- Iss-Rev:
- Approved by:
- Date:
- File name:
- (in symbol MOD_RASPBERRYPI_ZERO, part A) 16mA MAX/PIN; 50mA MAX/PCKG

### Library data of the parts
C23 = C_10uF_25V_X7R_1206_10: Capacitor; Manufacturer: Samsung Electro-Mechanics; Manufacturer Part Number: CL31B106KAHNNNE; Tolerance (%): 10; Part Number: C_10uF_25V_X7R_1206_10; HelpURL: http://www.tme.eu/pl/Document/4a42202b32dab16128fe107dd69598cc/samsung-chip-cap.pdf; Supplier 1: TME; Supplier Part Number 1: CL31B106KAHNNNE; Supplier 2: RS Components; Supplier 3: Farnell; Supplier 4: Mouser; Supplier 5: Digi-Key
C35 = C_100nF_50V_X7R_0603_5: as C45 on sheet IMU; Part Number: C_100nF_50V_X7R_0603_5; HelpURL: http://www.tme.eu/pl/Document/4a42202b32dab16128fe107dd69598cc/samsung-chip-cap.pdf; Supplier 1: TME; Supplier Part Number 1: CL10B104JB8NNNC; Supplier 2: RS Components; Supplier 3: Farnell; Supplier 4: Mouser; Supplier 5: Digi-Key
D9 = OL_G_0603_OSG80603C1E: LED GREEN; Manufacturer: Optosupply; Part Number: OL_G_0603_OSG80603C1E; Manufacturer Part Number: OSG80603C1E; Supplier 1: TME; Supplier Part Number 1: OSG80603C1E; Supplier 2: RS Components; Supplier 3: Farnell; Supplier 4: Mouser; Supplier 5: Digi-Key
J5 = J_HEADER_2x20_2.54_VERTICAL: Header, 40-Pin, Dual row; Manufacturer: Connfly; Part Number: J_HEADER_2x20_2.54_VERTICAL; Component Type: Standard; HelpURL: http://www.tme.eu/pl/Document/efd0203e2d3a140765df98191085ea88/DS1023.pdf; Manufacturer Part Number: DS1023-2*20S01; Supplier 1: TME; Supplier Part Number 1: ZL262-40DG; Supplier 2: RS Components; Supplier 3: Farnell; Supplier 4: Mouser; Supplier 5: Digi-Key
P1 = P_HEADER_2x20_2.54_HIGH: Header, 19-Pin, Dual row; Manufacturer: Ninigi; Part Number: P_HEADER_2x20_2.54_HIGH; Component Type: Standard; HelpURL: -; Manufacturer Part Number: ZL2019-40; Supplier 1: TME; Supplier Part Number 1: ZL2019-2X20; Supplier 2: RS Components; Supplier 3: Farnell; Supplier 4: Mouser; Supplier 5: Digi-Key
R10 = R_0R_0603_5: Manufacturer: Samsung; Manufacturer Part Number: RC1608J000CS; Voltage: 50V; Power: 100mW; Tolerance: 5%; Part Number: R_0R_0603_5; HelpURL: http://www.samsungsem.com/kr/support/product-search/chip-resistor/RC1608J000CS.jsp; Supplier 1: TME; Supplier 2: RS Components; Supplier 3: Farnell; Supplier 4: Mouser; Supplier 5: Digi-Key; Supplier Part Number 5: 1276-3510-1-ND
R30 = R_100k_0603_1: as R38 on sheet ESP32; Part Number: R_100k_0603_1; HelpURL: http://www.tme.eu/pl/Document/b315665a56acbc42df513c99b390ad98/ROYALOHM-THICKFILM.pdf; Supplier 1: TME; Supplier Part Number 1: SMD0603-100K-1%; Supplier 2: RS Components; Supplier 3: Farnell; Supplier 4: Mouser; Supplier Part Number 4: 667-ERJ-3EKF1003V; Supplier 5: Digi-Key; Supplier Part Number 5: P100KHCT-ND
R31 = R_1k_0603_1: as R44 on sheet ESP32; Part Number: R_1k_0603_1; HelpURL: http://www.farnell.com/datasheets/2310790.pdf?_ga=2.256888843.1690599162.1548417389-1379097396.1542296996&_gac=1.262631934.1547230258.Cj0KCQiAmuHhBRD0ARIsAFWyPwhX8HcvXnM3tA0ZBodZLzDIjH2ZxLpjT5LWo9bad_HPRbU8LfPq44UaAhEwEALw_wcB; Supplier 1: TME; Supplier 2: RS Components; Supplier Part Number 2: 678-9875P; Supplier 3: Farnell; Supplier Part Number 3: 1469740; Supplier 4: Mouser; Supplier Part Number 4: 71-CRCW0603-1.0K-E3; Supplier 5: Digi-Key; Supplier Part Number 5: 541-1.00KHCT-ND
U9 = U_TXS0102DCTT: Manufacturer: Texas Instruments; Part Number: U_TXS0102DCTT; HelpURL: http://www.ti.com/lit/ds/symlink/txs0102.pdf; Manufacturer Part Number: TXS0102DCTT; Supplier 1: TME; Supplier 2: RS Components; Supplier Part Number 2: 7098912P; Supplier 3: Farnell; Supplier Part Number 3: 2098018; Supplier 4: Mouser; Supplier Part Number 4: 595-TXS0102DCTT; Supplier 5: Digi-Key; Supplier Part Number 5: 296-32603-1-ND
U10 = U_ADP198ACPZ-R7: Manufacturer: Analog Devices; Part Number: U_ADP198ACPZ-R7; HelpURL: https://datasheet.octopart.com/ADP198ACBZ-11-R7-Analog-Devices-datasheet-10979622.pdf; Manufacturer Part Number: ADP198ACPZ-R7; Supplier 1: TME; Supplier 2: RS Components; Supplier Part Number 2: 153-3184; Supplier 3: Farnell; Supplier Part Number 3: 2457351; Supplier 4: Mouser; Supplier Part Number 4: 584-ADP198ACPZ-R7; Supplier 5: Digi-Key; Supplier Part Number 5: ADP198ACPZ-R7CT-ND
MOD3 = MOD_RASPBERRYPI_ZERO: Part Number: MOD_RASPBERRYPI_ZERO; SCH_Footprint: MOD_RASPBERRYPI_ZERO; HelpURL: https://cdn.sparkfun.com/assets/learn_tutorials/6/7/6/PiZero_1.pdf; Manufacturer: Raspberry Pi; Manufacturer Part Number: RASPBERRY PI ZERO; Supplier 1: TME; Supplier 2: RS Components; Supplier 3: Farnell; Supplier 4: Mouser; Supplier 5: Digi-Key

## Sheet Input_Output.SchDoc: Motherboard-Input_Output
size A4; Author: Patryk Bujak; DrawnBy: Patryk Bujak; DocumentNumber: 12; Revision: 1.0; SheetNumber: 4; SheetTotal: 10
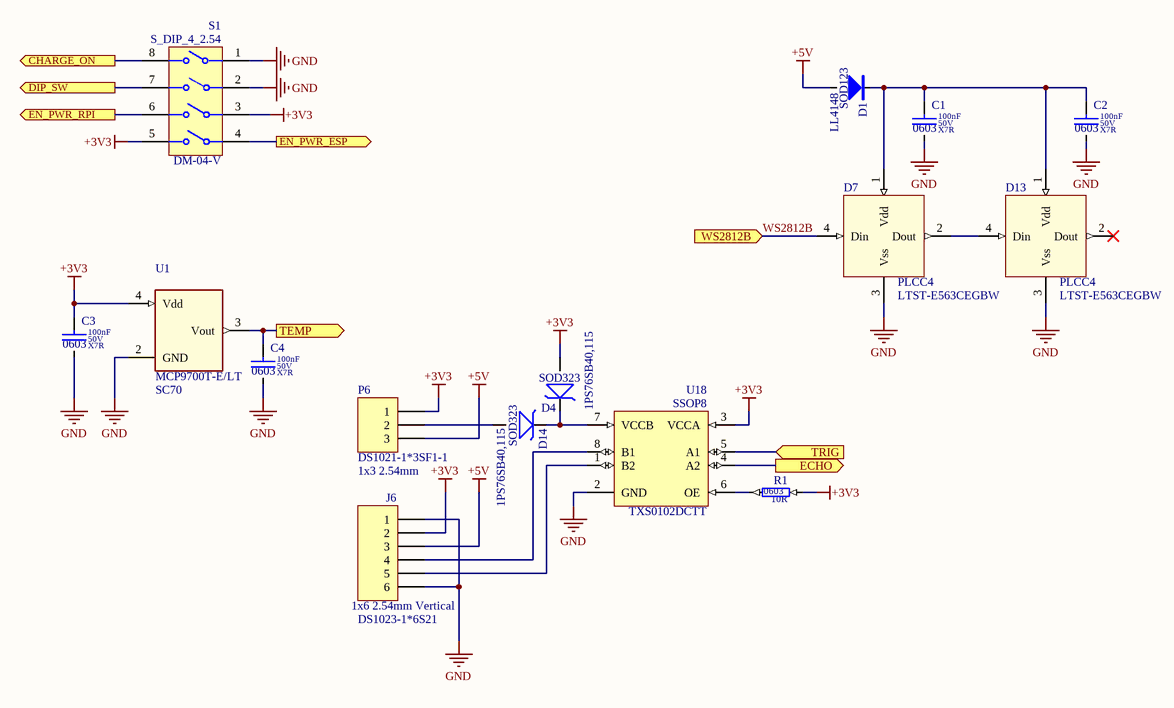
[diagram p8: Input_Output.SchDoc]

### Parts
C1  value 100nF  Dielectric: X7R  Voltage: 50V  SCH_Footprint: 0603  [C_0603_1608]  (hidden comment: Ceramic X7R)
C2  value 100nF  Dielectric: X7R  Voltage: 50V  SCH_Footprint: 0603  [C_0603_1608]  (hidden comment: Ceramic X7R)
C3  value 100nF  Dielectric: X7R  Voltage: 50V  SCH_Footprint: 0603  [C_0603_1608]  (hidden comment: Ceramic X7R)
C4  value 100nF  Dielectric: X7R  Voltage: 50V  SCH_Footprint: 0603  [C_0603_1608]  (hidden comment: Ceramic X7R)
D1  value LL4148  [SOD123]  (hidden comment: 1N4148W)
D4  value 1PS76SB40,115  [SOD323]  (hidden comment: 1PS76SB40)
D7  value LTST-E563CEGBW  SCH_Footprint: PLCC4  [PLCC4_5050]  (hidden comment: SMD LED with built-in embedded IC)
D13  value LTST-E563CEGBW  SCH_Footprint: PLCC4  [PLCC4_5050]  (hidden comment: SMD LED with built-in embedded IC)
D14  value 1PS76SB40,115  [SOD323]  (hidden comment: 1PS76SB40)
J6  value DS1023-1*6S21  SCH_Footprint: 1x6 2.54mm Vertical  [J_HEADER_1x6_2.54_VERTICAL]  (hidden comment: Goldpin female straight)
P6  value DS1021-1*3SF1-1  SCH_Footprint: 1x3 2.54mm  [P_HEADER_1x3_2.54]  (hidden comment: Goldpin)
R1  value 10R  SCH_Footprint: 0603  [R_0603_1608]  (hidden comment: Resistor)
S1  value DM-04-V  SCH_Footprint: S_DIP_4_2.54  [DM-04-V]  (hidden comment: DIP SWITCH 4 POS)
U1  SCH_Footprint: SC70  [SC70-5_SOT353_TSSOP5]  (hidden comment: MCP9700T-E/LT)
U18  value TXS0102DCTT  SCH_Footprint: SSOP8  [SSOP8_3x3]  (hidden comment: 2-Bit Bidirectional Voltage-Level Shifter for Open-Drain and Push-Pull Application 8-VSSOP -40 to 85)

### Ports
CHARGE_ON (out), DIP_SW (out), ECHO (out), EN_PWR_ESP (out), EN_PWR_RPI (out), TEMP (out), TRIG (in), WS2812B (in)

### Nets
+3V3: C3.1 D4.2 J6.2 P6.1 R1.1 S1.3 S1.5 U1.4(Vdd) U18.3(VCCA)
+5V: D1.2 J6.3 P6.3
GND: C1.2 C2.2 C3.2 C4.2 D7.3(Vss) D13.3(Vss) J6.1 J6.6 S1.1 S1.2 U1.2(GND) U18.2(GND)
EN_PWR_RPI: S1.6 ; port EN_PWR_RPI
WS2812B: D7.4(Din) ; port WS2812B
NetC1_1: C1.1 C2.1 D1.1 D7.1(Vdd) D13.1(Vdd)
NetC4_1: C4.1 U1.3(Vout) ; port TEMP
NetD4_1: D4.1 D14.1 U18.7(VCCB)
NetD7_2: D7.2(Dout) D13.4(Din)
NetD14_2: D14.2 P6.2
NetJ6_4: J6.4 U18.8(B1)
NetJ6_5: J6.5 U18.1(B2)
NetR1_2: R1.2 U18.6(OE)
NetR11_2: S1.4 ; port EN_PWR_ESP
NetR61_1: S1.8 ; port CHARGE_ON
NetS1_7: S1.7 ; port DIP_SW
NetU7_29: U18.5(A1) ; port TRIG
NetU7_30: U18.4(A2) ; port ECHO

Not connected (* = marked no-connect by the designer): D13 2(Dout)*

### Notes on the sheet
- Title:
- Sheet:
- of
- Author:
- Model:
- Document Number:
- Checked by:
- Iss-Rev:
- Approved by:
- Date:
- File name:

### Library data of the parts
C1-C4 = C_100nF_50V_X7R_0603_5: as C45 on sheet IMU; Part Number: C_100nF_50V_X7R_0603_5; HelpURL: http://www.tme.eu/pl/Document/4a42202b32dab16128fe107dd69598cc/samsung-chip-cap.pdf; Supplier 1: TME; Supplier Part Number 1: CL10B104JB8NNNC; Supplier 2: RS Components; Supplier 3: Farnell; Supplier 4: Mouser; Supplier 5: Digi-Key
D1 = D_1N4148W_0A15_75V_SOD123: Manufacturer: Fairchild Semiconductor; Voltage: 75V; Current: 0.15A; SCH_Footprint: SOD123; Part Number: D_1N4148W_0A15_75V_SOD123; Manufacturer Part Number: LL4148; Supplier 1: TME; Supplier 2: RS Components; Supplier 3: Farnell; Supplier 4: Mouser; Supplier Part Number 4: 771-PMLL4148L-T/R; Supplier 5: Digi-Key; Supplier Part Number 5: LL4148FSCT
D4 D14 = DS_1PS76SB40_40V_SOD323: Manufacturer: Nexperia; Voltage: 40V; Current: 120mA; SCH_Footprint: SOD323; Part Number: DS_1PS76SB40_40V_SOD323; HelpURL: https://datasheet.octopart.com/BAS40H%2C115-Nexperia-datasheet-8446890.pdf; Manufacturer Part Number: 1PS76SB40,115; Supplier 1: TME; Supplier Part Number 1: 1PS76SB40.115; Supplier 2: RS Components; Supplier Part Number 2: 509419; Supplier 3: Farnell; Supplier Part Number 3: 1349646; Supplier 4: Mouser; Supplier Part Number 4: 771-1PS76SB40115; Supplier 5: Digi-Key; Supplier Part Number 5: 1727-1187-1-ND
D7 D13 = OL_LTST-E563CEGBW: Manufacturer: Lite-On; Part Number: OL_LTST-E563CEGBW; HelpURL: https://www.tme.eu/Document/594934e57b4d934542266695a36c177d/AN500301_v3.0.pdf; Manufacturer Part Number: LTST-E563CEGBW; Supplier 1: TME; Supplier Part Number 1: LTST-E563CEGBW; Supplier 2: RS Components; Supplier 3: Farnell; Supplier 4: Mouser; Supplier Part Number 4: 859-LTST-E563CEGBW; Supplier 5: Digi-Key; Supplier Part Number 5: 160-2264-1-ND
J6 = J_HEADER_1x6_2.54_VERTICAL: Header, 6-Pin; Manufacturer: Connfly; Part Number: J_HEADER_1x6_2.54_VERTICAL; Component Type: Standard; HelpURL: https://www.tme.eu/Document/584b1a60cf2e8809a936c5f5ff2de0d5/zl262-sg.pdf; Manufacturer Part Number: DS1023-1*6S21; Supplier 1: TME; Supplier Part Number 1: ZL262-6SG; Supplier 2: RS Components; Supplier 3: Farnell; Supplier 4: Mouser; Supplier 5: Digi-Key
P6 = P_HEADER_1x3_2.54: Header, 3-Pin; Manufacturer: Connfly; Part Number: P_HEADER_1x3_2.54; Component Type: Standard; HelpURL: http://www.tme.eu/en/Document/cc301e58a5da78cb543a94b5a5b7f06a/DS1021.pdf; Manufacturer Part Number: DS1021-1*3SF1-1; Supplier 1: TME; Supplier Part Number 1: ZL201-03G; Supplier 2: RS Components; Supplier 3: Farnell; Supplier 4: Mouser; Supplier 5: Digi-Key
R1 = R_10R_0603_1: as R47 on sheet IMU; Part Number: R_10R_0603_1; HelpURL: http://www.tme.eu/pl/Document/b315665a56acbc42df513c99b390ad98/ROYALOHM-THICKFILM.pdf; Supplier 1: TME; Supplier Part Number 1: SMD0603-10R-1%; Supplier 2: RS Components; Supplier 3: Farnell; Supplier 4: Mouser; Supplier 5: Digi-Key
S1 = S_DM-04-V: Manufacturer: DIPTRONICS; Part Number: S_DM-04-V; HelpURL: https://www.tme.eu/pl/Document/3859235cbbc3386afa52bad431a134f4/DM-SERIES.pdf; Manufacturer Part Number: DM-04-V; Supplier 1: TME; Supplier Part Number 1: ESD104E; Supplier 2: RS Components; Supplier 3: Farnell; Supplier 4: Mouser; Supplier Part Number 4: 113-DM04VTR; Supplier 5: Digi-Key
U1 = U_MCP9700T-E/LT: Manufacturer: Microchip; Part Number: U_MCP9700T-E/LT; Value: MCP9700T-E/LT; HelpURL: http://www.mouser.com/ds/2/268/20001942F-461622.pdf; Manufacturer Part Number: MCP9700T-E/LT; Supplier 1: TME; Supplier 2: RS Components; Supplier 3: Farnell; Supplier Part Number 3: 1084621; Supplier 4: Mouser; Supplier Part Number 4: 579-MCP9700T-E/LT; Supplier 5: Digi-Key; Supplier Part Number 5: MCP9700T-E/LTCT-ND
U18 = U_TXS0102DCTT: Manufacturer: Texas Instruments; Part Number: U_TXS0102DCTT; HelpURL: http://www.ti.com/lit/ds/symlink/txs0102.pdf; Manufacturer Part Number: TXS0102DCTT; Supplier 1: TME; Supplier 2: RS Components; Supplier Part Number 2: 7098912P; Supplier 3: Farnell; Supplier Part Number 3: 2098018; Supplier 4: Mouser; Supplier Part Number 4: 595-TXS0102DCTT; Supplier 5: Digi-Key; Supplier Part Number 5: 296-32603-1-ND